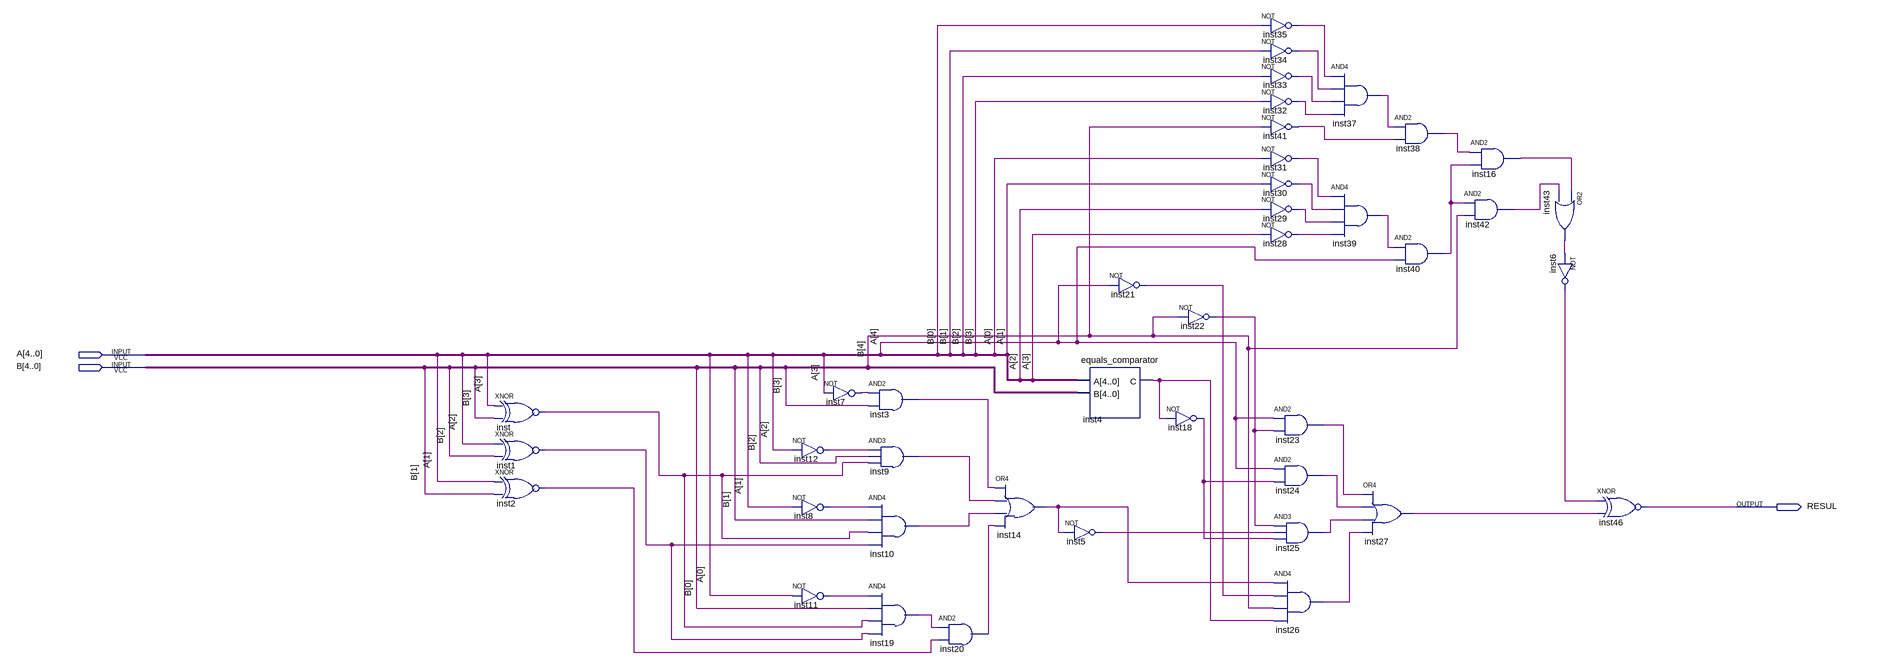
[diagram p0: schematic sheet]
// Quartus schematic less_comparator.bdf as structural Verilog: 41 symbols, 3 pins
module less_comparator (
  input  [4:0] A,
  input  [4:0] B,
  output RESUL
);

  wire inst1_out, inst2_out, inst3_out, inst4_c, inst5_out, inst6_out, inst7_out, inst8_out, inst9_out,
       inst10_out, inst11_out, inst12_out, inst14_out, inst16_out, inst18_out, inst19_out, inst20_out,
       inst21_out, inst22_out, inst23_out, inst24_out, inst25_out, inst26_out, inst27_out, inst28_out,
       inst29_out, inst30_out, inst31_out, inst32_out, inst33_out, inst34_out, inst35_out, inst37_out,
       inst38_out, inst39_out, inst40_out, inst41_out, inst42_out, inst43_out, inst_out;

  xnor inst (inst_out, A[3], B[3]);
  xnor inst1 (inst1_out, A[2], B[2]);
  xnor inst2 (inst2_out, A[1], B[1]);
  not inst12 (inst12_out, A[2]);
  not inst8 (inst8_out, A[1]);
  not inst11 (inst11_out, A[0]);
  not inst7 (inst7_out, A[3]);
  and inst3 (inst3_out, inst7_out, B[3]);
  and inst9 (inst9_out, inst12_out, B[2], inst_out);
  and inst10 (inst10_out, inst8_out, B[1], inst_out, inst1_out);
  and inst19 (inst19_out, inst11_out, B[0], inst_out, inst1_out);
  and inst20 (inst20_out, inst19_out, inst2_out);
  or inst14 (inst14_out, inst3_out, inst9_out, inst10_out, inst20_out);
  not inst5 (inst5_out, inst14_out);
  not inst21 (inst21_out, A[4]);
  equals_comparator inst4 (.A(A), .B(B), .C(inst4_c));
  not inst18 (inst18_out, inst4_c);
  not inst22 (inst22_out, B[4]);
  not inst35 (inst35_out, B[0]);
  not inst34 (inst34_out, B[1]);
  not inst33 (inst33_out, B[2]);
  not inst32 (inst32_out, B[3]);
  not inst41 (inst41_out, B[4]);
  not inst31 (inst31_out, A[0]);
  not inst30 (inst30_out, A[1]);
  not inst29 (inst29_out, A[2]);
  not inst28 (inst28_out, A[3]);
  and inst23 (inst23_out, A[4], inst22_out);
  and inst24 (inst24_out, A[4], inst18_out);
  and inst25 (inst25_out, inst22_out, inst5_out, inst18_out);
  and inst26 (inst26_out, inst14_out, inst21_out, B[4], inst4_c);
  and inst37 (inst37_out, inst35_out, inst34_out, inst33_out, inst32_out);
  and inst39 (inst39_out, inst31_out, inst30_out, inst29_out, inst28_out);
  or inst27 (inst27_out, inst23_out, inst24_out, inst25_out, inst26_out);
  and inst38 (inst38_out, inst37_out, inst41_out);
  and inst40 (inst40_out, inst39_out, A[4]);
  and inst16 (inst16_out, inst38_out, inst40_out);
  and inst42 (inst42_out, inst40_out, B[4]);
  or inst43 (inst43_out, inst16_out, inst42_out);
  not inst6 (inst6_out, inst43_out);
  xnor inst46 (RESUL, inst6_out, inst27_out);
endmodule
